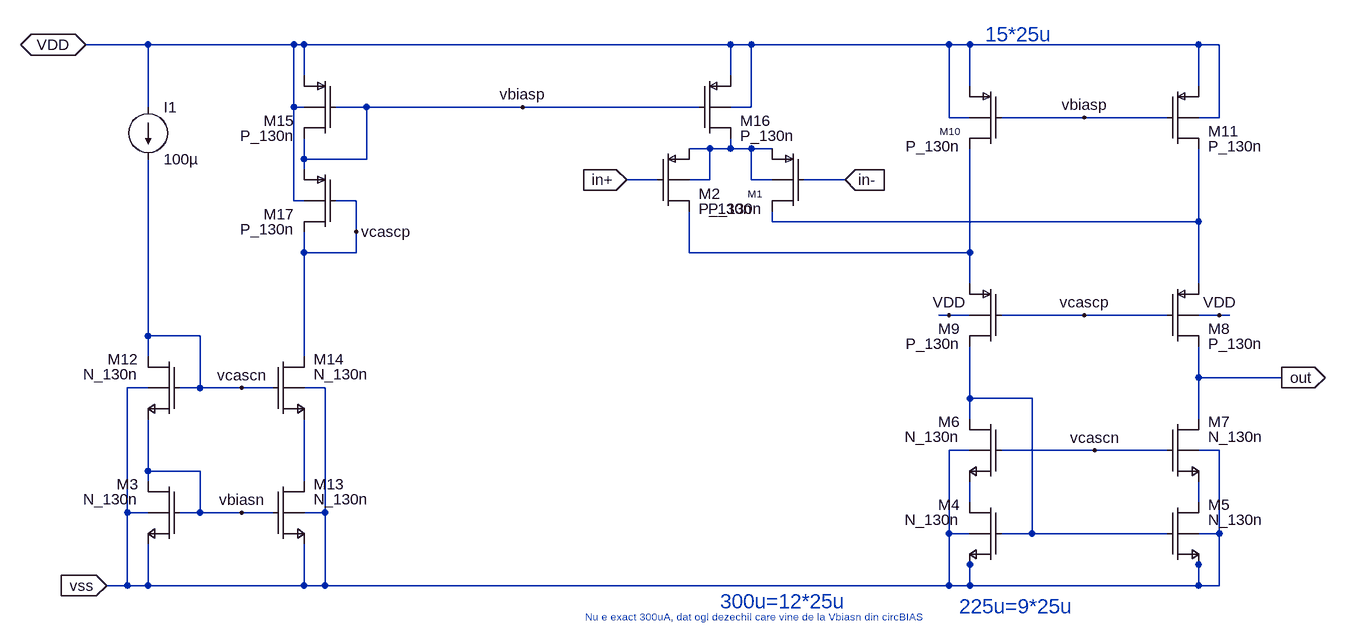
[diagram p0: schematic foldedCascode.asc]
foldedCascode.asc, the LTspice schematic file:
Version 4
SHEET 1 1072 700
WIRE -1696 -224 -1792 -224
WIRE -1472 -224 -1696 -224
WIRE -1456 -224 -1472 -224
WIRE -800 -224 -1456 -224
WIRE -768 -224 -800 -224
WIRE -464 -224 -768 -224
WIRE -432 -224 -464 -224
WIRE -80 -224 -432 -224
WIRE -48 -224 -80 -224
WIRE -1456 -176 -1456 -224
WIRE -800 -176 -800 -224
WIRE -432 -160 -432 -224
WIRE -80 -160 -80 -224
WIRE -1696 -128 -1696 -224
WIRE -1472 -128 -1472 -224
WIRE -1456 -128 -1472 -128
WIRE -1360 -128 -1408 -128
WIRE -1120 -128 -1360 -128
WIRE -848 -128 -1120 -128
WIRE -768 -128 -768 -224
WIRE -768 -128 -800 -128
WIRE -464 -112 -464 -224
WIRE -432 -112 -464 -112
WIRE -256 -112 -384 -112
WIRE -128 -112 -256 -112
WIRE -48 -112 -48 -224
WIRE -48 -112 -80 -112
WIRE -832 -64 -864 -64
WIRE -800 -64 -800 -80
WIRE -800 -64 -832 -64
WIRE -768 -64 -800 -64
WIRE -736 -64 -768 -64
WIRE -1456 -48 -1456 -80
WIRE -1360 -48 -1360 -128
WIRE -1360 -48 -1456 -48
WIRE -1456 -32 -1456 -48
WIRE -912 -16 -960 -16
WIRE -832 -16 -832 -64
WIRE -832 -16 -864 -16
WIRE -768 -16 -768 -64
WIRE -736 -16 -768 -16
WIRE -624 -16 -688 -16
WIRE -1472 16 -1472 -128
WIRE -1456 16 -1472 16
WIRE -1376 16 -1408 16
WIRE -736 48 -736 32
WIRE -80 48 -80 -64
WIRE -80 48 -736 48
WIRE -1376 64 -1376 16
WIRE -1456 96 -1456 64
WIRE -1376 96 -1376 64
WIRE -1376 96 -1456 96
WIRE -864 96 -864 32
WIRE -432 96 -432 -64
WIRE -432 96 -864 96
WIRE -432 144 -432 96
WIRE -80 144 -80 48
WIRE -464 192 -480 192
WIRE -432 192 -464 192
WIRE -256 192 -384 192
WIRE -128 192 -256 192
WIRE -48 192 -80 192
WIRE -32 192 -48 192
WIRE -1696 224 -1696 -48
WIRE -1616 224 -1696 224
WIRE -1696 256 -1696 224
WIRE -1456 256 -1456 96
WIRE -80 288 -80 240
WIRE 48 288 -80 288
WIRE -1696 304 -1728 304
WIRE -1616 304 -1616 224
WIRE -1616 304 -1648 304
WIRE -1552 304 -1616 304
WIRE -1504 304 -1552 304
WIRE -1424 304 -1456 304
WIRE -432 320 -432 240
WIRE -336 320 -432 320
WIRE -432 352 -432 320
WIRE -80 352 -80 288
WIRE -432 400 -464 400
WIRE -240 400 -384 400
WIRE -128 400 -240 400
WIRE -48 400 -80 400
WIRE -1696 432 -1696 352
WIRE -1616 432 -1696 432
WIRE -1696 448 -1696 432
WIRE -1456 448 -1456 352
WIRE -432 480 -432 448
WIRE -80 480 -80 448
WIRE -1728 496 -1728 304
WIRE -1696 496 -1728 496
WIRE -1616 496 -1616 432
WIRE -1616 496 -1648 496
WIRE -1552 496 -1616 496
WIRE -1504 496 -1552 496
WIRE -1424 496 -1424 304
WIRE -1424 496 -1456 496
WIRE -464 528 -464 400
WIRE -432 528 -464 528
WIRE -336 528 -336 320
WIRE -336 528 -384 528
WIRE -128 528 -336 528
WIRE -48 528 -48 400
WIRE -48 528 -80 528
WIRE -432 576 -432 560
WIRE -80 576 -80 560
WIRE -1728 608 -1728 496
WIRE -1728 608 -1760 608
WIRE -1696 608 -1696 544
WIRE -1696 608 -1728 608
WIRE -1456 608 -1456 544
WIRE -1456 608 -1696 608
WIRE -1424 608 -1424 496
WIRE -1424 608 -1456 608
WIRE -464 608 -464 528
WIRE -464 608 -1424 608
WIRE -432 608 -432 576
WIRE -432 608 -464 608
WIRE -80 608 -80 576
WIRE -80 608 -432 608
WIRE -48 608 -48 528
WIRE -48 608 -80 608
FLAG -1792 -224 VDD
IOPIN -1792 -224 BiDir
FLAG -464 192 VDD
FLAG -48 192 VDD
FLAG -256 -112 vbiasp
FLAG -1120 -128 vbiasp
FLAG -960 -16 in+
IOPIN -960 -16 In
FLAG -624 -16 in-
IOPIN -624 -16 In
FLAG -1552 304 vcascn
FLAG -1552 496 vbiasn
FLAG -1376 64 vcascp
FLAG -256 192 vcascp
FLAG 48 288 out
IOPIN 48 288 Out
FLAG -1760 608 vss
IOPIN -1760 608 In
FLAG -240 400 vcascn
DATAFLAG -512 48 ""
DATAFLAG -464 96 ""
DATAFLAG 0 288 ""
SYMBOL nmosb -384 480 M0
WINDOW 0 63 4 Left 2
SYMATTR InstName M4
SYMATTR Value N_130n
SYMATTR Value2 l=2.0u w=4.0u ad=800.0f as=800.0f pd=8.4u ps=8.4u m=1
SYMBOL nmosb -128 480 R0
WINDOW 0 63 4 Left 2
SYMATTR InstName M5
SYMATTR Value N_130n
SYMATTR Value2 l=2.0u w=4.0u ad=800.0f as=800.0f pd=8.4u ps=8.4u m=1
SYMBOL nmosb -384 352 M0
WINDOW 0 63 4 Left 2
SYMATTR InstName M6
SYMATTR Value N_130n
SYMATTR Value2 l=2.0u w=4.0u ad=800.0f as=800.0f pd=8.4u ps=8.4u m=1
SYMBOL nmosb -128 352 R0
WINDOW 0 63 4 Left 2
SYMATTR InstName M7
SYMATTR Value N_130n
SYMATTR Value2 l=2.0u w=4.0u ad=800.0f as=800.0f pd=8.4u ps=8.4u m=1
SYMBOL pmosb -128 144 R0
WINDOW 0 63 69 Left 2
SYMATTR InstName M8
SYMATTR Value P_130n
SYMATTR Value2 l=2.0u w=4.0u ad=800.0f as=800.0f pd=8.4u ps=8.4u m=1
SYMBOL pmosb -384 144 M0
WINDOW 0 63 69 Left 2
SYMATTR InstName M9
SYMATTR Value P_130n
SYMATTR Value2 l=2.0u w=4.0u ad=800.0f as=800.0f pd=8.4u ps=8.4u m=1
SYMBOL pmosb -384 -160 M0
WINDOW 0 63 69 Left 1
SYMATTR InstName M10
SYMATTR Value P_130n
SYMATTR Value2 l=2.0u w=4.0u ad=800.0f as=800.0f pd=8.4u ps=8.4u m=1
SYMBOL pmosb -128 -160 R0
WINDOW 0 63 69 Left 2
SYMATTR InstName M11
SYMATTR Value P_130n
SYMATTR Value2 l=1u w=14u ad=2.8p as=2.8p pd=28.4u ps=28.4u m=15
SYMBOL pmosb -688 -64 M0
WINDOW 0 63 69 Left 1
SYMATTR InstName M1
SYMATTR Value P_130n
SYMATTR Value2 l=1u w=14u ad=2.8p as=2.8p pd=28.4u ps=28.4u m=15
SYMBOL pmosb -912 -64 R0
WINDOW 0 63 69 Left 2
SYMATTR InstName M2
SYMATTR Value P_130n
SYMATTR Value2 l=1u w=14u ad=2.8p as=2.8p pd=28.4u ps=28.4u m=15
SYMBOL current -1696 -128 R0
WINDOW 123 0 0 Left 0
WINDOW 39 0 0 Left 0
SYMATTR InstName I1
SYMATTR Value 100µ
SYMBOL nmosb -1648 448 M0
WINDOW 0 63 4 Left 2
SYMATTR InstName M3
SYMATTR Value N_130n
SYMATTR Value2 l=2.0u w=4.0u ad=800.0f as=800.0f pd=8.4u ps=8.4u m=1
SYMBOL nmosb -1648 256 M0
WINDOW 0 63 4 Left 2
SYMATTR InstName M12
SYMATTR Value N_130n
SYMATTR Value2 l=2.0u w=4.0u ad=800.0f as=800.0f pd=8.4u ps=8.4u m=1
SYMBOL nmosb -1504 448 R0
WINDOW 0 63 4 Left 2
SYMATTR InstName M13
SYMATTR Value N_130n
SYMATTR Value2 l=2.0u w=4.0u ad=800.0f as=800.0f pd=8.4u ps=8.4u m=1
SYMBOL nmosb -1504 256 R0
WINDOW 0 63 4 Left 2
SYMATTR InstName M14
SYMATTR Value N_130n
SYMATTR Value2 l=2.0u w=4.0u ad=800.0f as=800.0f pd=8.4u ps=8.4u m=1
SYMBOL pmosb -1408 -176 M0
WINDOW 0 63 69 Left 2
SYMATTR InstName M15
SYMATTR Value P_130n
SYMATTR Value2 l=2.0u w=4.0u ad=800.0f as=800.0f pd=8.4u ps=8.4u m=1
SYMBOL pmosb -848 -176 R0
WINDOW 0 63 69 Left 2
SYMATTR InstName M16
SYMATTR Value P_130n
SYMATTR Value2 l=2.0u w=4.0u ad=800.0f as=800.0f pd=8.4u ps=8.4u m=1
SYMBOL pmosb -1408 -32 M0
WINDOW 0 63 69 Left 2
SYMATTR InstName M17
SYMATTR Value P_130n
SYMATTR Value2 l=2.0u w=4.0u ad=800.0f as=800.0f pd=8.4u ps=8.4u m=1
TEXT -448 640 Left 3 ;225u=9*25u
TEXT -816 632 Left 3 ;300u=12*25u
TEXT -1024 656 Left 1 ;Nu e exact 300uA, dat ogl dezechil care vine de la Vbiasn din circBIAS
TEXT -408 -240 Left 3 ;15*25u

The netlist it stands for:
* foldedCascode.asc
M4 N006 N004 vss vss N_130n l=2.0u w=4.0u ad=800.0f as=800.0f pd=8.4u ps=8.4u m=1
M5 N007 N004 vss vss N_130n l=2.0u w=4.0u ad=800.0f as=800.0f pd=8.4u ps=8.4u m=1
M6 N004 vcascn N006 vss N_130n l=2.0u w=4.0u ad=800.0f as=800.0f pd=8.4u ps=8.4u m=1
M7 out vcascn N007 vss N_130n l=2.0u w=4.0u ad=800.0f as=800.0f pd=8.4u ps=8.4u m=1
M8 out vcascp N002 VDD P_130n l=2.0u w=4.0u ad=800.0f as=800.0f pd=8.4u ps=8.4u m=1
M9 N004 vcascp N003 VDD P_130n l=2.0u w=4.0u ad=800.0f as=800.0f pd=8.4u ps=8.4u m=1
M10 N003 vbiasp VDD VDD P_130n l=2.0u w=4.0u ad=800.0f as=800.0f pd=8.4u ps=8.4u m=1
M11 N002 vbiasp VDD VDD P_130n l=1u w=14u ad=2.8p as=2.8p pd=28.4u ps=28.4u m=15
M1 N002 in- N001 N001 P_130n l=1u w=14u ad=2.8p as=2.8p pd=28.4u ps=28.4u m=15
M2 N003 in+ N001 N001 P_130n l=1u w=14u ad=2.8p as=2.8p pd=28.4u ps=28.4u m=15
I1 VDD vcascn 100µ
M3 vbiasn vbiasn vss vss N_130n l=2.0u w=4.0u ad=800.0f as=800.0f pd=8.4u ps=8.4u m=1
M12 vcascn vcascn vbiasn vss N_130n l=2.0u w=4.0u ad=800.0f as=800.0f pd=8.4u ps=8.4u m=1
M13 N005 vbiasn vss vss N_130n l=2.0u w=4.0u ad=800.0f as=800.0f pd=8.4u ps=8.4u m=1
M14 vcascp vcascn N005 vss N_130n l=2.0u w=4.0u ad=800.0f as=800.0f pd=8.4u ps=8.4u m=1
M15 vbiasp vbiasp VDD VDD P_130n l=2.0u w=4.0u ad=800.0f as=800.0f pd=8.4u ps=8.4u m=1
M16 N001 vbiasp VDD VDD P_130n l=2.0u w=4.0u ad=800.0f as=800.0f pd=8.4u ps=8.4u m=1
M17 vcascp vcascp vbiasp VDD P_130n l=2.0u w=4.0u ad=800.0f as=800.0f pd=8.4u ps=8.4u m=1
.model NMOS NMOS
.model PMOS PMOS
.lib standard.mos
* 225u=9*25u
* 300u=12*25u
* Nu e exact 300uA, dat ogl dezechil care vine de la Vbiasn din circBIAS
* 15*25u
.backanno
.end